# EAGLE board pico (EAGLE 9.4.0)
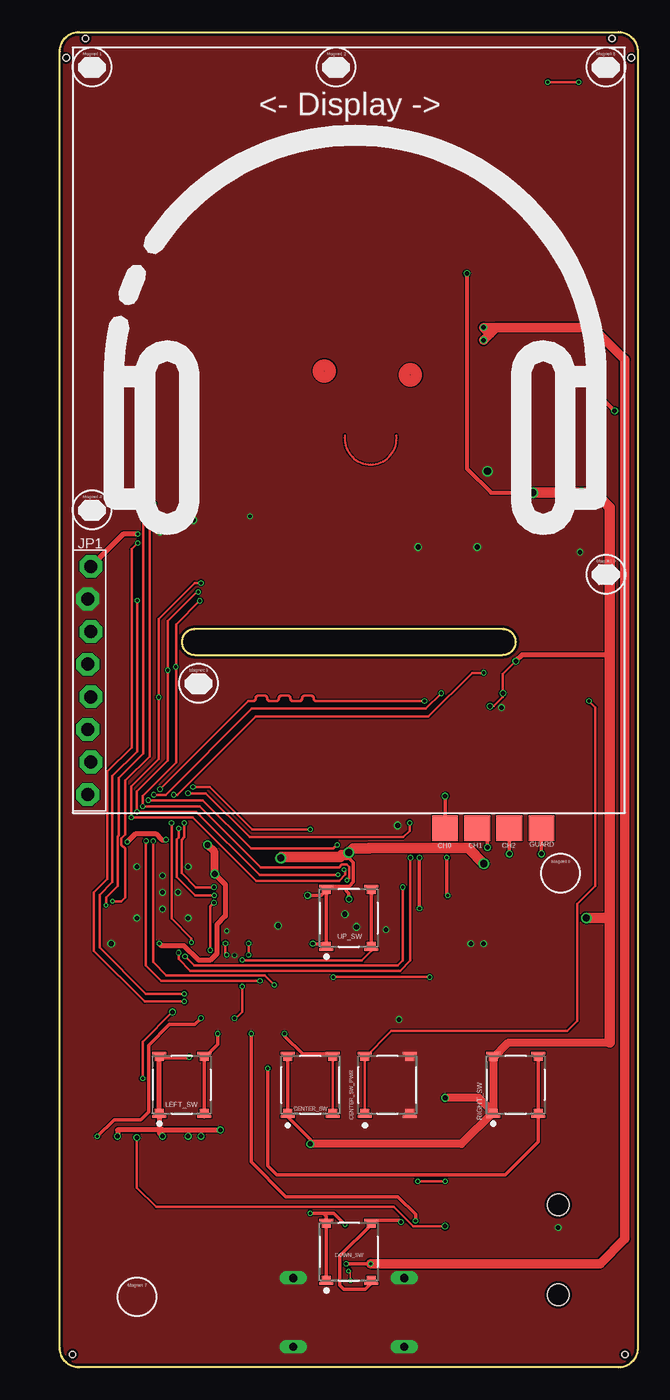
[diagram p10: board, top side]
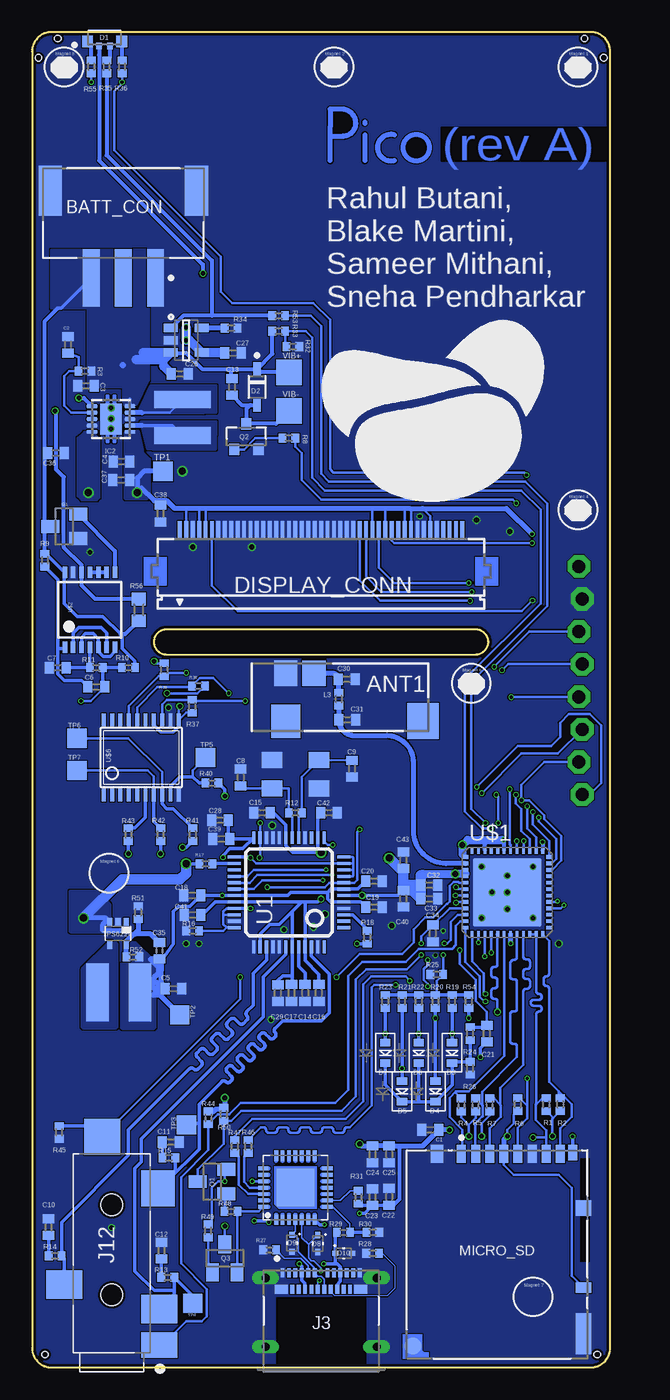
[diagram p11: board, bottom side, seen from below]

Size 45 x 104 mm. Coordinates in mm from the lower left corner, seen from the top.
Outline: 43.5,104 arc-90 45,102.5 45,1.5 arc-90 43.5,0 1.5,0 arc-90 0,1.5 0,102.5 arc-90 1.5,104 43.5,104
Outline: 10.5,55.5 34.5,55.5 arc90 35.5,56.5 arc90 34.5,57.5 10.5,57.5 arc90 9.5,56.5 arc90 10.5,55.5
Copper layers (1*16): Top 0.035mm / dielectric 1.5mm / Bottom 0.035mm
Design rules "jlcpcb": minimum track width 3.5mil, minimum drill 0.2mm, track to track 3.5mil, track to pad 3.5mil, pad to pad 6mil, via to via 6mil, smd to smd 6mil, copper to edge 0.2mm, drill to drill 0.2mm, minimum pad ring 3mil, minimum via ring 3mil, stop-mask expansion 4mil, vias tented up to drill 0mil, thermal gap 10mil
Holes 0.5 mm at 44,1 1,1 0.5,102 44.5,102 2,103.5 43,103.5

## Footprints (pad centres in the part's own frame; a part is rotated, then mirrored left to right if it is on the bottom)
PRO-OB-440_1 = smd 2 x 1.8: 1 1.865,-2.65; 2 1.865,-4.85 | smd 2.6 x 2.25: 3 -1.865,-2.65 | smd 2.8 x 2.45: 4 -1.865,-13.35
JST_S3B-XH-SM4-TB_0 = smd 1.3 x 4.5: 1 -2.5,5.05; 2 0,5.05; 3 2.5,5.05 | smd 1.8 x 3.9: 4 -5.7,-1.75; 5 5.7,-1.75
C0402 = smd 0.7 x 0.9: 1 -0.65,0; 2 0.65,0
E-SWITCH_TL3315NF100Q_0 = smd 0.5 x 0.7: 1 -2.125,1.75; 2 2.125,1.75; 3 -2.125,-1.75; 4 2.125,-1.75 | smd 0.2 x 1.1: 1-2 -2.475,1.75; 2-2 2.475,1.75; 3-2 -2.475,-1.75; 4-2 2.475,-1.75
TP20SQ = smd 2 x 2: TP 0,0
BROADCOM_HSMF-C113_0 = smd 0.85 x 0.9: 1 -1.325,-0.25; 4 1.325,-0.25 | smd 0.45 x 0.5: 2 -0.425,-0.6; 3 0.425,-0.6
ON_SEMI_1N914BWS_0 = smd 1.05 x 0.55: 1 -1.4,0; 2 1.4,0
SOD-523 = smd 0.8 x 0.6: A 0,-0.8; K 0,0.8
ON_SEMICONDUCTOR_ESD5Z5.0T1G_0 = smd 0.48 x 0.4: 1 -0.66,0; 2 0.66,0
FH12-45S-0.5SH = smd 0.3 x 1.3: 1 -13,3.25; 2 -12.5,3.25; 3 -12,3.25; 4 -11.5,3.25; 5 -11,3.25; 6 -10.5,3.25; 7 -10,3.25; 8 -9.5,3.25; 9 -9,3.25; 10 -8.5,3.25; 11 -8,3.25; 12 -7.5,3.25; 13 -7,3.25; 14 -6.5,3.25; 15 -6,3.25; 16 -5.5,3.25; 17 -5,3.25; 18 -4.5,3.25; 19 -4,3.25; 20 -3.5,3.25; 21 -3,3.25; 22 -2.5,3.25; 23 -2,3.25; 24 -1.5,3.25; 25 -1,3.25; 26 -0.5,3.25; 27 0,3.25; 28 0.5,3.25; 29 1,3.25; 30 1.5,3.25; 31 2,3.25; 32 2.5,3.25; 33 3,3.25; 34 3.5,3.25; 35 4,3.25; 36 4.5,3.25; 37 5,3.25; 38 5.5,3.25; 39 6,3.25; 40 6.5,3.25; 41 7,3.25; 42 7.5,3.25; 43 8,3.25; 44 8.5,3.25; 45 9,3.25
E-SWITCH_TL3315NF160Q_0 = smd 0.5 x 0.7: 1 -2.125,1.75; 2 2.125,1.75; 3 -2.125,-1.75; 4 2.125,-1.75 | smd 0.2 x 1.1: 1-2 -2.475,1.75; 2-2 2.475,1.75; 3-2 -2.475,-1.75; 4-2 2.475,-1.75
SOT23 = smd 1 x 1.4: 1 -0.95,-1.1; 2 0.95,-1.1; 3 0,1.1
DRC-S-PVSON-N10 = smd 0.28 x 0.85: 1 -1,-1.475; 2 -0.5,-1.475; 3 0,-1.475; 4 0.5,-1.475; 5 1,-1.475; 6 1,1.475; 7 0.5,1.475; 8 0,1.475; 9 -0.5,1.475; 10 -1,1.475 | smd 2.4 x 1.65: TH 0,0
MOLEX_105450-0101_0 = drill 0.635 pad 1.067 long: 1 -4.32,3.36; 2 4.32,3.36; 3 -4.32,-2; 4 4.32,-2 | smd 0.3 x 0.7: A1 -3,3.77; A2 -2.5,3.77; A3 -2,3.77; A4 -1.5,3.77; A5 -1,3.77; A6 -0.5,3.77; A7 0.5,3.77; A8 1,3.77; A9 1.5,3.77; A10 2,3.77; A11 2.5,3.77; A12 3,3.77; B2 2.25,2.47; B3 1.75,2.47; B4 1.25,2.47; B5 0.75,2.47; B6 0.25,2.47; B7 -0.25,2.47; B8 -0.75,2.47; B9 -1.25,2.47; B10 -1.75,2.47; B11 -2.25,2.47 | smd 1 x 0.7: B1 3.1,2.47; B12 -3.1,2.47
CUI_SJ-43515TS-SMT = smd 2 x 2.8: 1 -7.15,-3.7 | smd 2.8 x 2.6: 2 5.05,-3.6 | smd 2.2 x 2.8: 3 -2.45,3.7; 4 -4.35,-3.7 | smd 2.8 x 2.8: 5 9.05,0.75 | hole 1.7: -3.25,0; 3.75,0
QFN28 = smd 2.9 x 2.9: P$0 0,0 | smd 0.8 x 0.3: P$1 -2.5,1.5; P$2 -2.5,1; P$3 -2.5,0.5; P$4 -2.5,0; P$5 -2.5,-0.5; P$6 -2.5,-1; P$7 -2.5,-1.5; P$15 2.5,-1.5; P$16 2.5,-1; P$17 2.5,-0.5; P$18 2.5,0; P$19 2.5,0.5; P$20 2.5,1; P$21 2.5,1.5 | smd 0.3 x 0.8: P$8 -1.5,-2.5; P$9 -1,-2.5; P$10 -0.5,-2.5; P$11 0,-2.5; P$12 0.5,-2.5; P$13 1,-2.5; P$14 1.5,-2.5; P$22 1.5,2.5; P$23 1,2.5; P$24 0.5,2.5; P$25 0,2.5; P$26 -0.5,2.5; P$27 -1,2.5; P$31 -1.5,2.5
1X08-LOCK = drill 1.016 pad 1.778 octagon: 1 -8.89,0.127; 2 -6.35,-0.127; 3 -3.81,0.127; 4 -1.27,-0.127; 5 1.27,0.127; 6 3.81,-0.127; 7 6.35,0.127; 8 8.89,-0.127
R0402 = smd 0.6 x 0.7: 1 -0.5,0; 2 0.5,0
HIROSE_DM3BT-DSF-PEJS_0 = smd 0.7 x 1.4: 1 -2.775,7.825; 2 -1.675,7.825; 3 -0.575,7.825; 4 0.525,7.825; 5 1.625,7.825; 6 2.725,7.825; 7 3.825,7.825; 8 4.925,7.825 | smd 0.7 x 1.2: 9 5.875,7.925 | smd 1.2 x 0.8: 10 6.725,-2.575 | smd 1 x 1.4: 11 -4.675,7.825 | smd 1.2 x 1.2: 12 6.725,3.625 | smd 1.311 x 1.311: 13 -6.553,-7.116 | smd 1.2 x 3.2: 14 6.725,-6.175
ON_SEMI_MMBT5551LT1G_0 = smd 0.9 x 0.8: 1 -1,0.95; 2 -1,-0.95; 3 1,0
R0603 = smd 1 x 1.1: 1 -0.85,0; 2 0.85,0
TP15SQ = smd 1.5 x 1.5: TP 0,0
TSP62240 = smd 0.4 x 0.7: 1 -0.65,-0.85; 2 0,-0.85; 3 0.65,-0.85; 4 0.65,0.85; 5 -0.65,0.85
LQFP48 = smd 0.25 x 1: 1 -2.75,-4.25; 2 -2.25,-4.25; 3 -1.75,-4.25; 4 -1.25,-4.25; 5 -0.75,-4.25; 6 -0.25,-4.25; 7 0.25,-4.25; 8 0.75,-4.25; 9 1.25,-4.25; 10 1.75,-4.25; 11 2.25,-4.25; 12 2.75,-4.25; 25 2.75,4.25; 26 2.25,4.25; 27 1.75,4.25; 28 1.25,4.25; 29 0.75,4.25; 30 0.25,4.25; 31 -0.25,4.25; 32 -0.75,4.25; 33 -1.25,4.25; 34 -1.75,4.25; 35 -2.25,4.25; 36 -2.75,4.25 | smd 1 x 0.25: 13 4.25,-2.75; 14 4.25,-2.25; 15 4.25,-1.75; 16 4.25,-1.25; 17 4.25,-0.75; 18 4.25,-0.25; 19 4.25,0.25; 20 4.25,0.75; 21 4.25,1.25; 22 4.25,1.75; 23 4.25,2.25; 24 4.25,2.75; 37 -4.25,2.75; 38 -4.25,2.25; 39 -4.25,1.75; 40 -4.25,1.25; 41 -4.25,0.75; 42 -4.25,0.25; 43 -4.25,-0.25; 44 -4.25,-0.75; 45 -4.25,-1.25; 46 -4.25,-1.75; 47 -4.25,-2.25; 48 -4.25,-2.75
MICROCHIP_MCP73831T-2ATI-OT_1 = smd 1.1 x 0.65: 1 -1.2,0.95; 2 -1.2,0; 3 -1.2,-0.95; 4 1.2,-0.95; 5 1.2,0.95
QFN48 = smd 0.55 x 0.3: 1 -3.275,2.75; 2 -3.275,2.25; 3 -3.275,1.75; 4 -3.275,1.25; 5 -3.275,0.75; 6 -3.275,0.25; 7 -3.275,-0.25; 8 -3.275,-0.75; 9 -3.275,-1.25; 10 -3.275,-1.75; 11 -3.275,-2.25; 12 -3.275,-2.75; 25 3.275,-2.75; 26 3.275,-2.25; 27 3.275,-1.75; 28 3.275,-1.25; 29 3.275,-0.75; 30 3.275,-0.25; 31 3.275,0.25; 32 3.275,0.75; 33 3.275,1.25; 34 3.275,1.75; 35 3.275,2.25; 36 3.275,2.75 | smd 0.3 x 0.55: 13 -2.75,-3.275; 14 -2.25,-3.275; 15 -1.75,-3.275; 16 -1.25,-3.275; 17 -0.75,-3.275; 18 -0.25,-3.275; 19 0.25,-3.275; 20 0.75,-3.275; 21 1.25,-3.275; 22 1.75,-3.275; 23 2.25,-3.275; 24 2.75,-3.275; 37 2.75,3.275; 38 2.25,3.275; 39 1.75,3.275; 40 1.25,3.275; 41 0.75,3.275; 42 0.25,3.275; 43 -0.25,3.275; 44 -0.75,3.275; 45 -1.25,3.275; 46 -1.75,3.275; 47 -2.25,3.275; 48 -2.75,3.275 | smd 5.309 x 5.309: EXP 0,0
TSSOP14 = smd 0.35 x 0.9: 1 -1.95,-2.925; 2 -1.3,-2.925; 3 -0.65,-2.925; 4 0,-2.925; 5 0.65,-2.925; 6 1.3,-2.925; 7 1.95,-2.925; 8 1.95,2.925; 9 1.3,2.925; 10 0.65,2.925; 11 0,2.925; 12 -0.65,2.925; 13 -1.3,2.925; 14 -1.95,2.925
INDUCTOR = smd 1.3 x 4.4: P$1 -1.5,0.2; P$2 1.3,0.2
ECSCRYSTAL = smd 1.6 x 1.25: GND -1.83,1.12; GND2 1.84,-1.11; IN/OUT 1.82,1.12; IN/OUT2 -1.83,-1.11
INDUCTOR' = smd 1.75 x 4.5: P$1 -1.4,0.2; P$2 1.9,0.2
TSSOP20 = smd 0.305 x 0.991: 1 -2.925,-2.918; 2 -2.275,-2.918; 3 -1.625,-2.918; 4 -0.975,-2.918; 5 -0.325,-2.918; 6 0.325,-2.918; 7 0.975,-2.918; 8 1.625,-2.918; 9 2.275,-2.918; 10 2.925,-2.918; 11 2.925,2.918; 12 2.275,2.918; 13 1.625,2.918; 14 0.975,2.918; 15 0.325,2.918; 16 -0.325,2.918; 17 -0.975,2.918; 18 -1.625,2.918; 19 -2.275,2.918; 20 -2.925,2.918

## Placement (x,y rotation side)
ANT1  PRO-OB-440  [PRO-OB-440_1]  27.9,52.2 90 bottom
BATT_CON  JST_S3B-XH-SM4-TBJST_S3B-XH-SM4-TB_0_0  [JST_S3B-XH-SM4-TB_0]  37.9,89.9 180 bottom
C1  50μF  [C0402]  14,18.5 180 bottom
C2  0.1μF  [C0402]  42.2,79.65 90 bottom
C3  10μF  [C0402]  40.8,76.44 180 bottom
C4  10μF  [C0402]  38.04,70.55 180 bottom
C5  10μF  [C0402]  34,29.5 0 bottom
C6  1μF  [C0402]  40,53 180 bottom
C7  1μF  [C0402]  43,54.5 0 bottom
C8  33pF  [C0402]  28.76,45.94 270 bottom
C9  33pF  [C0402]  20.09,46.63 90 bottom
C10  10nF  [C0402]  43.73,10.92 90 bottom
C11  10nF  [C0402]  34.21,17.54 0 bottom
C12  47nF  [C0402]  34.93,9.09 90 bottom
C13  0.1μF  [C0402]  29.43,76.36 270 bottom
C14  1μF  [C0402]  23.74,29.17 270 bottom
C15  100nF  [C0402]  27.1,43.2 180 bottom
C16  100nF  [C0402]  22.68,29.17 270 bottom
C17  100nF  [C0402]  24.8,29.17 270 bottom
C18  100nF  [C0402]  32.53,36.76 180 bottom
C19  100nF  [C0402]  18.38,35.85 0 bottom
C20  100nF  [C0402]  18.38,37.87 0 bottom
C21  0.1μF  [C0402]  9.6,26 90 bottom
C22  4.7μF  [C0402]  17.2,13.28 90 bottom
C23  0.1μF  [C0402]  18.5,13.27 90 bottom
C24  4.7μF  [C0402]  18.5,16.6 270 bottom
C25  0.1μF  [C0402]  17.2,16.6 270 bottom
C26  4.7μF  [C0402]  33.5,77.39 0 bottom
C27  4.7μF  [C0402]  29.36,79 0 bottom
C28  10μF  [C0402]  30.36,42.61 180 bottom
C29  10μF  [C0402]  25.87,29.16 270 bottom
C30  2.7pF  [C0402]  20.5,53.6 0 bottom
C31  4.7pF  [C0402]  20.47,50.44 0 bottom
C32  10μF  [C0402]  14.08,37.56 0 bottom
C33  0.1μF  [C0402]  14.08,36.49 0 bottom
C34  0.1μF  [C0402]  13.8,33.8 270 bottom
C35  33pF  [C0402]  35.09,32.45 90 bottom
C36  100nF  [C0402]  43.15,71.21 0 bottom
C37  10μF  [C0402]  38.06,69.11 180 bottom
C38  0.1μF  [C0402]  35,66.5 270 bottom
C39  100nF  [C0402]  30.27,41.16 180 bottom
C40  100nF  [C0402]  16.1,36.5 270 bottom
C41  100nF  [C0402]  32.52,35.24 180 bottom
C42  100nF  [C0402]  21.89,43.2 0 bottom
C43  10μF  [C0402]  16.1,39.5 90 bottom
CENTER_SW  E-SWITCH_TL3315NF100QE-SWITCH_TL3315NF100Q_0_0  [E-SWITCH_TL3315NF100Q_0]  19.5,22 90 top
CENTER_SW_PWR  E-SWITCH_TL3315NF100QE-SWITCH_TL3315NF100Q_0_0  [E-SWITCH_TL3315NF100Q_0]  25.5,22 90 top
CH0  TPSQTP20SQ  [TP20SQ]  30,42 180 top
CH1  TPSQTP20SQ  [TP20SQ]  32.5,42 180 top
CH2  TPSQTP20SQ  [TP20SQ]  35,42 180 top
D1  BROADCOM_HSMF-C113BROADCOM_HSMF-C113_0_0  [BROADCOM_HSMF-C113_0]  39.36,103.51 0 bottom
D2  ON_SEMI_1N914BWSON_SEMI_1N914BWS_0_0  [ON_SEMI_1N914BWS_0]  27.49,76.36 270 bottom
D3  [SOD-523]  12.3,24.5 180 bottom
D4  [SOD-523]  13.6,21.5 180 bottom
D5  [SOD-523]  16.2,21.5 180 bottom
D6  [SOD-523]  14.9,24.5 180 bottom
D7  [SOD-523]  17.5,24.5 180 bottom
D8  ON_SEMICONDUCTOR_ESD5Z5.0T1GON_SEMICONDUCTOR_ESD5Z5.0T1G_0_0  [ON_SEMICONDUCTOR_ESD5Z5.0T1G_0]  22.76,9.65 270 bottom
D9  ON_SEMICONDUCTOR_ESD5Z5.0T1GON_SEMICONDUCTOR_ESD5Z5.0T1G_0_0  [ON_SEMICONDUCTOR_ESD5Z5.0T1G_0]  24.77,9.67 270 bottom
D10  ON_SEMICONDUCTOR_ESD5Z5.0T1GON_SEMICONDUCTOR_ESD5Z5.0T1G_0_0  [ON_SEMICONDUCTOR_ESD5Z5.0T1G_0]  20.74,8.89 0 bottom
DISPLAY_CONN  FH12-45S-0.5SH  [FH12-45S-0.5SH]  20.5,62 0 bottom
DOWN_SW  E-SWITCH_TL3315NF160QE-SWITCH_TL3315NF160Q_0_0  [E-SWITCH_TL3315NF160Q_0]  22.5,9 90 top
G1  APX809S-31SA  [SOT23]  42.5,65.5 90 bottom
GUARD  TPSQTP20SQ  [TP20SQ]  37.5,42 180 top
IC2  TPS6300  [DRC-S-PVSON-N10]  38.86,73.86 90 bottom
J3  MOLEX_105450-0101MOLEX_105450-0101_0_0  [MOLEX_105450-0101_0]  22.5,3.6 0 bottom
J12  3.5mm TRRS Jack  [CUI_SJ-43515TS-SMT]  38.8,8.9 90 bottom
JL  CP2102N-A02-GQFN28  [QFN28]  24.5,14 90 bottom
JP1  [1X08-LOCK]  2.3,53.5 90 top
L3  1.6nH  [R0402]  21.13,52.05 270 bottom
LEFT_SW  E-SWITCH_TL3315NF160QE-SWITCH_TL3315NF160Q_0_0  [E-SWITCH_TL3315NF160Q_0]  9.5,22 90 top
MICRO_SD  HIROSE_DM3BT-DSF-PEJSHIROSE_DM3BT-DSF-PEJS_0_0  [HIROSE_DM3BT-DSF-PEJS_0]  8.8,8.8 0 bottom
Q1  [SOT23]  30.99,14.47 90 bottom
Q2  ON_SEMI_MMBT5551LT1GON_SEMI_MMBT5551LT1G_0_0  [ON_SEMI_MMBT5551LT1G_0]  28.32,72.5 90 bottom
Q3  [SOT23]  30,8.5 0 bottom
R1  10kΩ  [R0402]  4.98,20.47 270 bottom
R2  10kΩ  [R0402]  3.88,20.48 270 bottom
R3  100Ω  [R0402]  40.88,77.6 0 bottom
R4  10kΩ  [R0402]  11.57,20.45 270 bottom
R5  10kΩ  [R0402]  10.47,20.45 270 bottom
R6  10kΩ  [R0402]  7.19,20.48 270 bottom
R7  10kΩ  [R0402]  9.38,20.45 270 bottom
R8  1.5kΩ  [R0402]  25.01,72.38 180 bottom
R9  100kΩ  [R0402]  44,62.87 90 bottom
R10  100kΩ  [R0402]  37.5,54.5 0 bottom
R11  10MΩ  [R0402]  40,54.5 180 bottom
R12  1MΩ  [R0402]  24.5,43.2 0 bottom
R13  10Ω  [R0402]  34.44,7 180 bottom
R14  20Ω  [R0402]  43.21,8.7 180 bottom
R15  20Ω  [R0402]  34.35,16.33 180 bottom
R16  100kΩ  [R0402]  32.5,34 180 bottom
R17  100kΩ  [R0402]  31.47,39.23 180 bottom
R18  100kΩ  [R0402]  18.9,33.5 270 bottom
R19  155kΩ  [R0402]  12.3,28.5 270 bottom
R20  75kΩ  [R0402]  13.6,28.5 270 bottom
R21  35kΩ  [R0402]  16.2,28.5 270 bottom
R22  15kΩ  [R0402]  14.9,28.5 270 bottom
R23  5kΩ  [R0402]  17.5,28.5 270 bottom
R24  50kΩ  [R0402]  10.9,26 90 bottom
R25  5kΩ  [R0402]  13.5,30.6 0 bottom
R26  10kΩ  [R0402]  10.9,23.3 90 bottom
R27  5.1kΩ  [R0402]  26.51,9.14 180 bottom
R28  5.1kΩ  [R0402]  18.49,8.88 180 bottom
R29  22.1kΩ  [R0402]  20.76,10.51 180 bottom
R30  47.5kΩ  [R0402]  18.47,10.53 180 bottom
R31  1kΩ  [R0402]  19.59,13.25 270 bottom
R32  10kΩ  [R0402]  24.7,79.5 180 bottom
R33  5kΩ  [R0402]  25.8,80.7 180 bottom
R34  2kΩ  [R0402]  29.5,80.94 0 bottom
R35  100Ω  [R0402]  39.2,101.3 270 bottom
R36  50Ω  [R0402]  38,101.3 270 bottom
R37  4.7kΩ  [R0402]  32.53,51.49 270 bottom
R38  4.7kΩ  [R0402]  32.05,53.08 0 bottom
R39  4.7kΩ  [R0402]  34.72,54.34 90 bottom
R40  10kΩ  [R0402]  31,45.5 0 bottom
R41  10kΩ  [R0402]  32.5,41.5 270 bottom
R42  10kΩ  [R0402]  35,41.5 270 bottom
R43  10kΩ  [R0402]  37.5,41.5 270 bottom
R44  10kΩ  [R0402]  31.27,19.44 90 bottom
R45  50kΩ  [R0402]  42.9,18.3 270 bottom
R46  1kΩ  [R0402]  28.18,17.21 270 bottom
R47  1kΩ  [R0402]  29.22,17.21 90 bottom
R48  10kΩ  [R0402]  29.51,12.14 180 bottom
R49  10kΩ  [R0402]  31.3,10.64 270 bottom
R50  10kΩ  [R0402]  30.07,19.72 90 bottom
R51  180kΩ  [R0402]  36.73,35.43 270 bottom
R52  360kΩ  [R0402]  37.16,31.96 0 bottom
R53  10kΩ  [R0402]  25.8,81.9 180 bottom
R54  315kΩ  [R0402]  11,28.5 270 bottom
R55  25Ω  [R0402]  40.4,101.3 270 bottom
R56  0Ω  [R0603]  36.7,59 90 bottom
RIGHT_SW  E-SWITCH_TL3315NF160QE-SWITCH_TL3315NF160Q_0_0  [E-SWITCH_TL3315NF160Q_0]  35.5,22 90 top
TP1  TPSQTP15SQ  [TP15SQ]  34.8,69.8 0 bottom
TP2  TPSQTP15SQ  [TP15SQ]  33.5,27.45 270 bottom
TP3  TPSQTP15SQ  [TP15SQ]  32.97,18.9 90 bottom
TP4  TPSQTP15SQ  [TP15SQ]  32.5,5 180 bottom
TP5  TPSQTP15SQ  [TP15SQ]  31.5,47.5 0 bottom
TP6  TPSQTP15SQ  [TP15SQ]  41.5,49 0 bottom
TP7  TPSQTP15SQ  [TP15SQ]  41.5,46.5 0 bottom
TPS6224  TPS62240  [TSP62240]  38.31,33.81 180 bottom
U1  VS1053-L  [LQFP48]  25,37 90 bottom
U2  MICROCHIP_MCP73831T-2ATI-OTMICROCHIP_MCP73831T-2ATI-OT_0_1  [MICROCHIP_MCP73831T-2ATI-OT_1]  33,80 0 bottom
U$1  ESP32-PICO-D4  [QFN48]  8,37 0 bottom
U$2  TOSHIBA-NAND-GATE  [TSSOP14]  40.5,59 0 bottom
U$3  2.2uH  [INDUCTOR]  33.49,73.87 270 bottom
U$4  ECS12P88MHZ  [ECSCRYSTAL]  24.5,46.2 0 bottom
U$5  CR43NP-2R2MC  [INDUCTOR']  38.5,29 0 bottom
U$6  COMMS-AT42QT2120XU  [TSSOP20]  36.5,47.5 0 bottom
UP_SW  E-SWITCH_TL3315NF160QE-SWITCH_TL3315NF160Q_0_0  [E-SWITCH_TL3315NF160Q_0]  22.5,35 90 top
VIB+  TPSQTP20SQ  [TP20SQ]  25,77.5 0 bottom
VIB-  TPSQTP20SQ  [TP20SQ]  25,74.5 0 bottom

## Tracks (layer width: path | path; a pad name or v marks a point on that pad's centre or on a via)
ATQ_CHANGE  (via drill 0.2, 0.25)
  Top 0.2: v10.25,33.1 10.25,33.4 8.7,34.95 v8.7,42.4 | v8.87,44.6 9.16,44.6 15.26,50.7 28.7,50.7 32.1,54.1 v33,54.1
  Bottom 0.2: U$6.17 37.48,51.5 35.14,53.84 R39.1 34.46,54.1 v33,54.1 | U$1.14 v10.25,33.1 | v8.7,42.4 8.7,44.43 v8.87,44.6
BLUE_GREEN_LED_CATH  (via drill 0.2, 0.25)
  Top 0.2: v40.4,100.1 v38,100.1 | v6.5,69.5 6.5,47.8 4.6,45.9 4.6,41.44 4.5,41.34 4.5,37.5 3.6,36.6 v3.6,36
  Bottom 0.2: R36.2 v38,100.1 38,100 38.6,99.4 38.6,94.8 30.3,86.5 30.3,83.8 29.4,82.9 23.1,82.9 21.8,81.6 21.8,69.95 21.55,69.7 6.7,69.7 v6.5,69.5 | v40.4,100.1 R55.2 | U$1.28 3.85,35.75 v3.6,36
BUTTON_ADC  (via drill 0.25)
  Top 0.2: v12.9,33.03 12.9,32.23 v13,32.13
  Bottom 0.2: U$1.10 11.85,35.25 12.4,34.7 12.4,33.3 12.67,33.03 v12.9,33.03 | v13,32.13 R25.2 13.5,30.1 13.5,29
  Bottom 0.254: R54.1 R19.1 13.5,29 R20.1 R22.1 R21.1 R23.1
BUTTON_DIN  (via drill 0.25)
  Top 0.2: v11.7,32.5 11.7,35.9 v12,36.2
  Bottom 0.2: C21.2 9.6,27.7 10.46,28.56 10.46,30.2 11.7,31.44 v11.7,32.5 | U$1.8 11.95,36.25 v12,36.2
  Bottom 0.254: R24.2 9.75,26.5 C21.2
CARD_DETECT  (via drill 0.25)
  Top 0.254: v2.93,18 4.23,19.3 6.3,19.3 6.92,19.92 6.92,25.1 8.52,26.7 10.5,26.7 v11,27.2
  Bottom 0.254: MICRO_SD.9 v2.93,18 | v11,27.2 R54.2
CENTER_SW_PWR_TOP  (via drill 0.25)
  Top 0.2: v41.2,51.9 41.7,51.4 41.7,37.5 40.3,36.1 40.3,27 39.5,26.2 25.82,26.2 CENTER_SW_PWR.2 CENTER_SW_PWR.1
  Bottom 0.2: v41.2,51.9 40.45,51.9 C6.1
  Bottom 0.254: R10.1 R11.1 39.5,53.15 C6.1
CHARGE_DETECT  (via drill 0.25)
  Top 0.2: v12,37.4 10.6,37.4 9.5,38.5 9.5,41.1 9.7,41.3 v9.7,42.4
  Bottom 0.2: R53.1 23.3,81.9 22.5,81.1 22.5,69.6 21.9,69 6.62,69 4.91,67.29 4.91,59.29 10.8,53.4 10.8,43.5 v9.7,42.4 | v12,37.4 11.85,37.25 U$1.6
CP_RSTB
  Bottom 0.127: JL.P$9 21,13 20.25,13.75 R31.1
DISPLAY_CS  (via drill 0.25)
  Top 0.2: v9.7,28.5 6.6,28.5 2.65,32.45 2.65,37 3.7,38.05 3.7,46.4 5.6,48.3 5.6,63.73 v6.07,64.2
  Bottom 0.2: DISPLAY_CONN.34 17,64.4 16.8,64.2 v6.07,64.2 | v9.7,28.5 9.78,28.5 10.15,28.87 10.15,30.45 11.28,31.58 U$1.12
DISPLAY_RST  (via drill 0.25)
  Top 0.2: v9.7,29.1 6.7,29.1 3.1,32.7 3.1,36.8 4.1,37.8 4.1,46.05 6.04,47.99 v6.04,59.73
  Bottom 0.2: DISPLAY_CONN.6 31,60.9 29,58.9 6.87,58.9 v6.04,59.73 | v9.7,29.1 9.83,29.23 9.83,30.69 10.75,31.61 U$1.13
DREQ  (via drill 0.25)
  Top 0.2: v9.75,32 10.45,31.3 26.3,31.3 26.7,31.7 v26.7,37.4 | v10.37,45.21 11.69,45.21 15,41.9 v19.5,41.9
  Bottom 0.2: U$1.15 v9.75,32 | v26.7,37.4 22.21,37.4 21.86,37.75 U1.8 19.9,37.75 19.7,37.95 19.7,41.7 v19.5,41.9 | JP1.1 1.59,44.61 0.7,45.5 0.7,50 1.6,50.9 3.2,50.9 3.9,50.2 3.9,49.1 4.6,48.4 7.18,48.4 v10.37,45.21
DTR
  Bottom 0.2: JL.P$31 27.36,12.14 R48.1 29.01,7.44 Q3.2
EN  (via drill 0.25)
  Top 0.2: v14.7,32.13 v14.7,33.03
  Bottom 0.2: Q1.3 32.09,15.41 30.07,17.43 R50.1 29.5,19.22 28.72,20 20.9,20 19.8,21.1 19.8,30.2 19,31 15.83,31 v14.7,32.13 | v14.7,33.03 14.7,33.55 C34.1 12.5,35.75 U$1.9
GND  (via drill 0.25, 0.3, 0.35, 0.4, 0.55)
  other vias: 38.84,74.72 38.84,73.89 38.85,73.11 40.5,63.5 34.39,51.39 38.8,10.9 25.4,34.1 32,33 33,33 26.4,27.1 33.3,69.8 8,37 6,39 8,38.3 10,39 9.2,37 8,35.7 10,35 6,35 13.6,32.1 13,34 27.9,63.9 32.5,63.9 26.3,42.21 17,34.4 22.2,35.3 23.1,34.3 14.81,66.29 7.8,65.1 10.4,66 4,33
  pour Top (rank 2, no thermals): 1.5,0 arc-90 0,1.5 0,102.5 arc-90 1.5,104 43.5,104 arc-90 45,102.5 45,1.5 arc-90 43.5,0
  cutout Top (no thermals): 10.5,57.5 arc90 9.5,56.5 arc90 10.5,55.5 34.5,55.5 arc90 35.5,56.5 arc90 34.5,57.5
  cutout Bottom (no thermals): 10.5,57.5 arc90 9.5,56.5 arc90 10.5,55.5 34.5,55.5 arc90 35.5,56.5 arc90 34.5,57.5
  pour Bottom (rank 2, no thermals): 1.5,0 arc-90 0,1.5 0,102.5 arc-90 1.5,104 43.5,104 arc-90 45,102.5 45,1.5 arc-90 43.5,0
I2C_SCL  (via drill 0.25)
  Top 0.2: v7.33,44.6 8.26,44.6 14.96,51.3 28.5,51.3 v29.7,52.5
  Bottom 0.2: U$6.16 36.83,51.41 35.24,53 32.63,53 R38.1 31.93,53.7 30.9,53.7 v29.7,52.5 | U$1.39 6.25,41.15 6.9,41.8 6.9,43.5 7.33,43.93 v7.33,44.6
I2C_SDA  (via drill 0.25)
  Top 0.2: v7.8,45.04 14.67,51.9 15.04,51.9 arc90 15.25,52.11 arc-90 15.46,52.32 15.94,52.32 arc-90 16.15,52.11 arc90 16.36,51.9 16.84,51.9 arc90 17.06,52.11 arc-90 17.27,52.32 17.75,52.32 arc-90 17.96,52.11 arc90 18.17,51.9 18.65,51.9 arc90 18.87,52.11 arc-90 19.08,52.32 19.56,52.32 arc-90 19.77,52.11 arc90 19.98,51.9 v28.4,51.9
  Bottom 0.2: U$6.13 34.88,51.62 34.5,52 R37.1 32.44,51.9 v28.4,51.9 | v7.8,45.04 7.8,40.73 7.75,40.67 U$1.42
IO2  (via drill 0.35)
  Top 0.2: v30,11 27.5,11 26,12.5 7.5,12.5 6,14 v6,17.91
  Bottom 0.2: MICRO_SD.7 4.98,18 | 4.98,18 4.98,18.48 5.78,19.28 5.78,20.47 5.75,20.5 | R1.1 5.28,20.97 5.75,20.5 | 5.75,20.5 5.75,27.5 arc90 5.54,27.71 arc-90 5.33,27.92 5.33,27.96 arc-90 5.54,28.17 5.96,28.17 arc90 6.17,28.38 6.17,28.42 arc90 5.96,28.63 5.54,28.63 arc-90 5.33,28.84 5.33,28.88 arc-90 5.54,29.09 arc90 5.75,29.3 U$1.23 U$1.22 | Q3.3 v30,11 | v6,17.91 5.07,17.91 4.98,18
IO4
  Bottom 0.2: MICRO_SD.8 3.88,18.62 3,19.5 3,20.5 3.5,21 | 3.5,21 3.86,21 R2.1 4,21.1 4,21.5 | U$1.24 4.75,33.23 4.75,30.66 arc90 4.96,30.45 arc-90 5.17,30.24 5.17,29.92 arc-90 4.96,29.71 arc90 4.75,29.5 4.75,22.25 4,21.5 | 3.5,21 4,21.5
IO12
  Bottom 0.2: MICRO_SD.1 11.5,16.7 11.5,18.5 12.5,19.5 12.5,21 12,21.5 | U$1.18 8.25,24.27 11.02,21.5 12,21.5 | R4.1 12,21.38 12,21.5
IO13
  Bottom 0.2: MICRO_SD.2 10.5,16.65 10.5,19 10,19.5 9.93,19.57 9.93,20.41 9.94,20.42 | 9.94,20.42 R5.1 | U$1.20 7.25,31.96 arc90 7.46,31.75 arc-90 7.78,31.43 7.78,30.45 arc-90 7.57,30.24 7.46,30.24 arc90 7.25,30.03 7.25,27.94 arc90 7.46,27.72 7.57,27.72 arc-90 7.78,27.51 7.78,25.42 arc-90 7.57,25.21 7.46,25.21 arc90 7.25,25 7.25,24.17 9.94,21.48 9.94,20.42
IO14  (via drill 0.25, 0.35)
  Top 0.2: v8.77,27.68 6.45,25.36 v6.45,22.51
  Bottom 0.2: MICRO_SD.5 7.18,18.66 6.44,19.39 6.44,20.36 | 8.77,33.71 8.77,31.39 arc90 8.98,31.18 9.03,31.18 arc-90 9.24,30.97 9.24,30.57 arc-90 9.03,30.36 8.98,30.36 arc90 8.77,30.15 8.77,29.75 arc90 8.98,29.53 9.03,29.53 arc-90 9.24,29.32 9.24,28.92 arc-90 9.03,28.71 8.98,28.71 arc90 8.77,28.5 v8.77,27.68 | R6.1 7.06,20.98 6.44,20.36 | 6.44,20.36 v6.44,22.5 v6.45,22.51
  Bottom 0.254: 8.77,33.71 U$1.17
IO15
  Bottom 0.2: MICRO_SD.3 9.38,18.62 8.5,19.5 8.5,20.42 8.54,20.46 | R7.1 9.03,20.95 8.54,20.46 | U$1.21 6.75,32 arc-90 6.54,31.79 6.45,31.79 arc90 6.23,31.58 6.23,31.23 arc90 6.45,31.02 6.54,31.02 arc-90 6.75,30.81 6.75,30.47 arc-90 6.54,30.26 6.45,30.26 arc90 6.23,30.05 6.23,29.7 arc90 6.45,29.49 6.54,29.49 arc-90 6.75,29.28 6.75,23.58 8.54,21.79 8.54,20.46
N$1
  Bottom 0.305: C13.2 28.68,74.96 28,74.96 | 28,74.96 D2.2 | 28,74.96 28.32,74.64 Q2.3 26,73.5 VIB-.TP
N$2
  Bottom 0.305: R55.1 40.4,102.97 D1.1
N$3
  Bottom 0.2: C2.1 41.38,78.69 R3.1 42.1,77.6 42.5,77.2 42.5,74.91 41.95,74.36 IC2.7
  Bottom 0.254: IC2.7 IC2.8
N$4
  Bottom 0.2: C8.2 28.56,45.09 U$4.IN/OUT2 25,45.09 R12.1 24.75,42.95 U1.18
N$5
  Bottom 0.254: R9.1 43,61.37 43,56 | C6.2 41.15,53.5 42.5,53.5 43,54 43,56 | U$2.1 42.52,56 43,56
N$6
  Bottom 0.254: U$3.P$2 34.08,73.36 36.45,73.36
  Bottom 0.406: 36.45,73.36 IC2.2
  pour Bottom (no thermals): 36.51,73.61 36.5,73.62 30.72,73.66 30.73,71.54 35.58,71.52 36,71.55
N$7
  Top 0.16: 22.2,72.6 arc195 26.2,72.6
N$8
  Bottom 0.2: U$3.P$1 34.3,74.36 36.45,74.36
  Bottom 0.406: 36.45,74.36 IC2.4
  pour Bottom (no thermals): 30.71,74.41 30.7,76.45 35.42,76.42 35.75,76.44 36.58,74.65 36.59,74.38 31.63,74.38
N$10
  pour Bottom (no thermals): 38.5,33 38.5,26.5 41,26.5 41,31 39,33
N$11
  Bottom 0.2: 32.5,46 32.5,46.5 TP5.TP
  Bottom 0.254: R40.1 32,45.5 32.5,46 33.5,46 34.23,45.27 U$6.9
N$12
  Bottom 0.254: U$2.7 38.55,55.76 38.92,55.38 39.48,55.38 39.85,55.76 U$2.5 | U$2.3 41.15,56.86 40.87,57.14 40.23,57.14 39.84,56.75 39.84,56.74 39.84,56.09
  Bottom 0.305: 39.84,56.09 U$2.5
N$13
  Bottom 0.406: 21.8,94 21.8,95.9 | 21.8,95.9 21.8,96.6 21.8,98 20.9,98 arc90 19.8,96.9 arc90 20.8,95.9 21.8,95.9
N$14
  Bottom 0.254: U$2.4 R11.2 C7.2
N$15
  Bottom 0.406: 19.1,96 19.1,94
N$16  (via drill 0.25)
  Top 0.2: UP_SW.3-2 24.25,32.45 23.5,31.7 14.23,31.7 v14.2,31.73 | v14.2,29.68 14.2,27.7 13.7,27.2 v13.6,27.2
  Top 0.254: UP_SW.3 UP_SW.4
  Bottom 0.2: v14.2,31.73 14.2,31.32 14.49,31.03 14.49,30.17 14.2,29.88 v14.2,29.68
  Bottom 0.254: R20.2 v13.6,27.2 D4.A
N$18  (via drill 0.35)
  Top 0.254: CH1.TP 33.3,41.2 v33.3,40.5
  Bottom 0.254: v33.3,40.5 33,40.5 R41.2
N$19
  Bottom 0.254: U$2.6 39.2,57.2 39.62,57.62 41.36,57.62 41.8,57.18 U$2.2
N$20  (via drill 0.35)
  Top 0.254: CH2.TP v35,40
  Bottom 0.254: v35,40 R42.2
N$21
  Bottom 0.2: C9.2 22.65,47.29 U$4.IN/OUT 24,46 R12.2 24.25,42.95 U1.17
N$22
  Bottom 0.2: R8.2 27.61,72.39 28.5,71.5 Q2.1
N$23
  Bottom 0.2: U$6.8 34.88,46.38 37.5,49 TP6.TP
  Bottom 0.254: R41.1 34,43.5 34.5,43.5 34.88,43.88 U$6.8
N$24  (via drill 0.25)
  Top 0.254: RIGHT_SW.4 RIGHT_SW.3 37.25,17.58 34.67,15 16.9,15 16.2,15.7 v16.2,23.3
  Bottom 0.254: R21.2 v16.2,23.3 D5.A
N$25
  Bottom 0.2: U$6.7 35.52,46.02 36,46.5 TP7.TP
  Bottom 0.254: R42.1 35.52,42.52 U$6.7
N$26
  Bottom 0.254: R43.1 37,42 36.17,42.83 U$6.6
N$27
  Bottom 0.254: U1.26 30.95,39.25 R17.1
N$28  (via drill 0.25)
  Top 0.254: DOWN_SW.4 21.8,8.67 21.8,6.4 22.1,6.1 23.8,6.1 24.25,6.55 DOWN_SW.3 | DOWN_SW.4-2 26.41,11.48 v26.57,11.32 | v27.7,11.43 27.7,11.93 26.33,13.3 17.6,13.3 14.9,16 v14.9,26
  Bottom 0.254: v26.57,11.32 26.68,11.43 v27.7,11.43 | R22.2 v14.9,26 D6.A
N$29  (via drill 0.25)
  Top 0.2: CENTER_SW.4 CENTER_SW.3
  Top 0.254: CENTER_SW.4 20.98,24.4 18.9,24.4 17.5,25.8 v17.5,26
  Bottom 0.254: R23.2 v17.5,26 D7.A
N$30
  Bottom 0.406: ANT1.2 21.61,54.06 arc90 C30.1 21.15,52.57 arc-90 L3.1
N$31
  Bottom 0.406: L3.2 C31.1 arc-90 19.88,49.2 17.4,49.2 arc90 15.3,47.1 15.3,41.79 arc-90 12.76,39.25 U$1.2
N$32
  Bottom 0.254: R24.1 R26.2 12.2,23.8 D3.K 12.3,22 D4.K 14.9,20.7 | 14.9,20.7 D5.K 17.5,22 D7.K | D6.K 14.9,20.7
N$33
  Bottom 0.305: U$2.9 U$2.10 U$2.11
N$34
  Bottom 0.254: R13.2 C12.1
N$35
  Bottom 0.254: R14.2 43.71,10.25 C10.1
N$36
  Bottom 0.254: C11.1 R15.2
N$37  (via drill 0.35)
  Top 0.254: CH0.TP v30,44.5
  Bottom 0.254: v30,44.5 30,45 R40.2
N$39
  Bottom 0.254: C14.1 23.74,30.74 24.25,31.25 U1.44
N$40  (via drill 0.35)
  Top 0.254: GUARD.TP v37.5,40
  Bottom 0.254: v37.5,40 R43.2
N$41
  Bottom 0.254: U1.3 20.05,35.25 18.9,34.1 R18.1
N$42
  Bottom 0.406: R52.1 TPS6224.5 37.66,33.17 37.07,33.76 37,33.76 | C35.2 35.75,33.76 37,33.76 | R51.2 36.73,34.03 37,33.76
N$43
  Bottom 0.305: G1.2 38.55,63.6 U$2.8
N$44
  Bottom 0.406: 19.1,97 19.1,96.9
N$45  (via drill 0.25)
  Top 0.254: v28,35.75 v28,39.7
  Bottom 0.2: 29.85,34.25 30.1,34.5 30.1,35.2 | U1.33 29.85,35.75 30.1,35.5 30.1,35.2 | U1.36 29.85,34.25 | U1.34 30.05,35.25 30.1,35.2 | 19.99,39.25 19.99,39.69 20.05,39.75 U1.12 | 19.99,39.25 19.99,38.75 | 19.99,38.75 19.99,38.31 20.05,38.25 U1.9 | 19.99,39.25 U1.11 27.54,39.24 v28,39.7 | 19.99,38.75 U1.10 | 29.85,34.25 30.1,34 R16.1
  Bottom 0.254: U1.33 v28,35.75 | v28,39.7 28.05,39.75 U1.25
N$46  (via drill 0.25)
  Top 0.254: LEFT_SW.3-2 LEFT_SW.4 12.3,25.17 v12.3,26
  Bottom 0.254: R19.2 v12.3,26 D3.A
N$47
  Bottom 0.406: 16.8,96 arc-210 16.8,94
N$48
  Bottom 0.254: J12.4 33.94,5.71 33.94,6 | 33.94,6 R13.1 32.5,5.56 TP4.TP | 33.94,6 35.5,6 37,7.5 37,15.5 36.5,16 36.5,17.79 27,27.29 27,30.4 25.25,32.15 U1.42
N$49
  Bottom 0.254: J12.3 42.5,8.49 R14.1 42.71,11.29 37.5,16.5 37.5,18.5 32.75,23.25 arc90 32.41,23.25 arc-90 32.08,23.25 31.82,23.5 arc-90 31.82,23.84 32.16,24.18 arc90 32.16,24.51 31.91,24.77 arc90 31.57,24.77 31.23,24.43 arc-90 30.89,24.43 30.64,24.69 arc-90 30.64,25.02 30.98,25.36 arc90 30.98,25.7 30.72,25.95 arc90 30.39,25.95 30.05,25.61 arc-90 29.71,25.61 29.46,25.87 arc-90 29.46,26.2 29.8,26.54 arc90 29.8,26.88 29.54,27.13 arc90 29.21,27.13 28.87,26.79 arc-90 28.53,26.79 28.28,27.05 arc-90 28.28,27.38 arc90 28.28,27.72 27.8,28.2 27.8,30.7 26.75,31.75 U1.39
N$50
  Bottom 0.102: J3.A5 23.5,7.9 24.08,8.48 25.35,8.48 R27.1
N$51
  Bottom 0.09: R28.1 17.72,8.88 16.77,7.93 16.77,6.17 17.35,5.59 21.45,5.59 21.75,5.88 J3.B5
N$52
  Bottom 0.127: R29.1 20.26,11.17 21.55,12.45 21.59,12.5 JL.P$8
  Bottom 0.254: R29.1 18.99,10.51 R30.2
N$54
  Bottom 0.406: R34.1 U2.5
N$55
  Bottom 0.305: R35.1 38.94,102.06 D1.3
N$56
  Bottom 0.305: R36.1 38,103.22 D1.4
N$57
  Bottom 0.254: R15.1 33.85,15.3 34.58,14.58 | J12.2 34.58,14.58 | U1.46 23.25,32.03 21.87,30.65 21.87,27.63 22.5,27 25.5,27 26.09,26.41 arc-90 26.09,26.08 arc90 26.09,25.74 26.17,25.65 arc90 26.51,25.65 26.85,25.99 arc-90 27.18,25.99 27.27,25.9 arc-90 27.27,25.56 26.93,25.23 arc90 26.93,24.89 27.02,24.8 arc90 27.36,24.8 27.7,25.14 arc-90 28.03,25.14 28.12,25.05 arc-90 28.12,24.71 27.79,24.38 arc90 27.79,24.04 27.88,23.95 arc90 28.21,23.95 28.55,24.29 arc-90 28.88,24.29 28.97,24.2 arc-90 28.97,23.86 28.64,23.53 arc90 28.64,23.19 28.73,23.1 arc90 29.06,23.1 29.4,23.44 arc-90 29.74,23.44 29.82,23.35 arc-90 29.82,23.01 29.49,22.67 arc90 29.49,22.34 29.58,22.25 arc90 29.91,22.25 arc-90 30.25,22.25 32,20.5 32,19 | 32,19 32,17 34.42,14.58 34.58,14.58 | 32,19 32.87,19 TP3.TP
N$58
  Bottom 0.2: Q1.1 30.01,13.4 R48.2
N$59
  Bottom 0.2: Q3.1 31.3,7.75 R49.2
RED_LED_CATH
  Bottom 0.305: U2.1 33.25,81.9 31,81.9 | R53.2 31,81.9 | R35.2 39.2,94.4 31,86.2 31,81.9
RTS  (via drill 0.25)
  Top 0.2: v27.86,14.5 v30,14.5
  Bottom 0.2: Q1.2 30,15.31 v30,14.5 30.5,14.5 31,14 31,11.44 R49.1 | JL.P$24 v27.86,14.5
RXD
  Bottom 0.2: R46.2 28.5,16.39 28.5,14.45 28.05,14 JL.P$25
RXD0  (via drill 0.25)
  Top 0.2: v15.59,30.11 7.89,30.11 6.7,31.3 6.7,40.98 v6.72,41
  Bottom 0.2: R47.2 29.22,18 27.88,19.34 20.6,19.34 19.2,20.74 19.2,29.83 18.59,30.44 15.92,30.44 v15.59,30.11 | U$1.40 6.72,40.3 v6.72,41
SPI_CLK  (via drill 0.2, 0.25)
  Top 0.2: v22.12,38.75 22.24,38.63 22.24,38.4 21.74,37.9 15.3,37.9 10.37,42.83 v5.56,42.83 5.56,45.26 7.7,47.4 v7.7,52.2 7.7,58.3 10.5,61.1 v11,61.1
  Bottom 0.2: DISPLAY_CONN.32 18,62.3 16.8,61.1 v11,61.1 | v22.12,38.75 27.75,38.75 28.25,38.25 U1.28 | v5.56,42.83 5.56,42.53 4.2,41.17 4.2,39.6 4.55,39.25 U$1.35 | v7.7,52.2 7.67,52.23 JP1.4
SPI_MISO  (via drill 0.2, 0.25)
  Top 0.2: v22.37,37.93 22.53,38.09 22.53,38.97 22.33,39.17 21.96,39.17 21.75,38.96 15.64,38.96 10.9,43.7 v6.45,43.7 6.45,44.5 9.05,47.1 9.05,54.54 | v10.9,59.71 9.05,57.86 9.05,54.54 | v9.02,54.57 9.05,54.54
  Bottom 0.2: DISPLAY_CONN.29 19.5,61.3 17.91,59.71 v10.9,59.71 | U1.30 27.75,37.25 27.08,37.92 v22.38,37.92 v22.37,37.93 | v6.45,43.7 6.45,41.98 5.75,41.27 U$1.38 | v9.02,54.57 6.28,57.31 JP1.6
SPI_MOSI  (via drill 0.2, 0.25)
  Top 0.2: v21.65,38.39 21.61,38.35 15.55,38.35 10.64,43.26 v6.01,43.26 6.01,44.86 8.41,47.26 v8.41,54.3 8.41,58.14 10.67,60.4 v10.77,60.4
  Bottom 0.2: DISPLAY_CONN.30 19,61.6 17.8,60.4 v10.77,60.4 | v21.65,38.39 21.69,38.39 21.74,38.34 27.46,38.34 28.05,37.75 U1.29 | U$1.36 4.73,41 6.01,42.28 v6.01,43.26 | v8.41,54.3 7.94,54.77 JP1.5
SYS_ENABLE  (via drill 0.35)
  Top 0.305: v43.2,74.5 42.2,75.5 v41.36,75.5
  Bottom 0.305: v41.36,75.5 40.98,75.5 IC2.6 | v43.2,74.5 43.14,74.44 43.14,69.98 42.52,69.36 42.52,63.87 41.15,62.5 U$2.12 41.15,60.9 40.1,59.85 R56.2
TRRS_INLINE_CTRL
  Bottom 0.2: J12.1 34.85,1.75 33,3.6 31.8,3.6 31.4,4 31.4,6.1 33.4,8.1 33.4,14.8 31.27,16.93 R44.1 31.27,18.98 30.53,19.72 29.65,19.72 28.77,20.6 21.4,20.6 20.4,21.6 20.4,30.5 19.3,31.6 15.9,31.6 14.9,32.6 12.3,32.6 12,32.9 12,34.4 11.65,34.75 U$1.11
TRRS_TIP_SW  (via drill 0.25)
  Top 0.2: v28.8,30.4 v21.3,30.4
  Bottom 0.2: J12.5 28.8,28.7 v28.8,30.4 | v21.3,30.4 19.5,32.2 16.2,32.2 15.3,33.1 15.3,34.11 14.38,35.03 13.77,35.03 12.7,36.1 12.69,36.1 12.49,36.3 12.49,37.52 12.18,37.83 11.82,37.83 11.74,37.75 U$1.5
  Bottom 0.254: J12.5 40.4,18.8 R45.1
TXD
  Bottom 0.2: JL.P$26 28.18,13.5 28.91,14.23 28.91,16.4 R47.1
TXD0  (via drill 0.25)
  Top 0.2: v16.7,29.8 15.96,30.54 8.3,30.54 7.28,31.56 v7.28,40.99
  Bottom 0.2: v16.7,29.8 18.36,29.8 18.56,29.6 18.56,20.41 20.27,18.7 20.47,18.7 arc-90 20.68,18.49 arc90 20.89,18.28 21.34,18.28 arc90 21.55,18.49 arc-90 21.76,18.7 22.21,18.7 arc-90 22.43,18.49 arc90 22.64,18.28 23.09,18.28 arc90 23.3,18.49 arc-90 23.51,18.7 23.96,18.7 arc-90 24.17,18.49 arc90 24.38,18.28 24.83,18.28 arc90 25.04,18.49 arc-90 25.25,18.7 25.7,18.7 arc-90 25.92,18.49 arc90 26.13,18.28 26.58,18.28 arc90 26.79,18.49 arc-90 27,18.7 27.19,18.7 R46.1 | v7.28,40.99 7.28,40.3 U$1.41
USB_D+
  Bottom 0.102: J3.B6 22.25,6.88 22.48,7.11 22.74,7.11 J3.A6 23.02,7.39 23.02,7.76 24.28,9.02 24.28,10.03 24.58,10.33 D9.1 24.5,10.6 JL.P$4
USB_D-  (via drill 0.2)
  Top 0.102: v22.49,7.52 22.63,7.38 v22.63,6.76
  Bottom 0.102: J3.A7 22.15,7.52 v22.49,7.52 22.49,7.73 23.08,8.31 23.26,8.31 23.48,8.53 23.48,9.59 | v22.63,6.76 22.75,6.64 J3.B7 | 23.48,9.59 D8.1 | 23.48,9.59 24,10.11 JL.P$5
V1P8  (via drill 0.25)
  Top 0.254: v30.13,39.71 30.13,36.82 v30.2,36.75
  Bottom 0.254: C18.1 v30.2,36.75 U1.31 25.1,36.75 24.85,37 22,37 | C18.1 | C19.1 19.43,36.25 U1.5 21.75,36.25 22,36.5 22,37 | C20.1 19.65,37.25 U1.7 21.75,37.25 22,37 | C28.1 29.71,41.25 C39.1 27.84,41.16 U1.24 28.6,40.4 29.6,40.4 30.13,39.87 v30.13,39.71 | C18.1 32.71,35.91 33.61,35.91 33.74,35.78 33.74,35.76 34,35.5 34,33 34.94,31.65
  Bottom 0.406: 34.94,30.94 34.94,31.65 C35.1 35.8,31.8 35.2,31.2 35.2,30.7 35.52,30.37 35.52,30.35 35.5,30.37 | 34.94,30.94 35.19,30.69 | 35.19,30.69 35.5,30.37 | 34.94,30 34.94,29.78 34.83,29.67 | 34.94,30 34.94,30.94 | C5.1 34.83,29.67 | C5.1 35,29.5 | 35,29.5 35.22,29.5 | 35.22,29.5 35.5,29.5 36,30 35.5,30 | 35.19,30.69 35,30.5 35,30 | 35,30 35,29.5 | 35.5,30 35.33,30 | 35.33,30 35,30 | 35.5,30 35.5,30.37 | 34.94,30 35,30 | 34.83,29.67 35.01,29.67 35.33,30 | C5.1 35.16,28.99 35.6,28.99 35.22,29.37 35.22,29.5 | TP2.TP 35,28.95 35,29.5
  pour Bottom (no thermals): 37,33 38,33 38,26.5 35.5,26.5 35.5,31.5
V3P3  (via drill 0.2, 0.25, 0.3, 0.35, 0.4, 0.45, 0.55)
  Top 0.2: v35.5,55 34.5,54 v34.5,52.5 34.5,52.2 33.8,51.5 v33.5,51.5 | 10,18.5 v10,18 | 11,18.5 v11,18
  Top 0.254: v22.22,11.11 21.33,12 20.5,12 | 20.5,12 v19.5,12 | 20.5,12 20.75,11.75 DOWN_SW.2 DOWN_SW.1 | 21.98,37.48 UP_SW.2-2 UP_SW.2 | 21.98,37.48 22.52,36.93 v22.52,36.48 | UP_SW.2 20.38,36.75 19.32,36.75 v19.3,36.77 | 24.1,40.43 24.1,40.45 | UP_SW.2 UP_SW.1 20.62,33 v19.7,33 | v10.09,24.16 10.05,24.12 LEFT_SW.2 | CENTER_SW.2 CENTER_SW.1 | CENTER_SW.1-2 19.5,17.77 v19.5,17.4 | 22.3,39.9 22.85,39.34 22.85,37.8 22.52,37.48 21.98,37.48
  Top 0.305: v31.7,85.2 31.7,70 33.58,68.12 37.9,68.12
  Top 0.406: LEFT_SW.2 LEFT_SW.1 7.75,18.75 | v35.5,55 36,55.5 42.82,55.5 | 7.75,18.75 8,18.5 | 8,18.5 10,18.5 11,18.5 v12.5,18.5 | 8,18.5 4.5,18.5 4.5,18.01 v4.48,18 | 7.75,18.75 7.75,18.25 v8,18 | v8.27,41.1 7.94,41.1 7.46,41.58 5.92,41.58 v5.26,40.92 | v12.06,38.43 12.89,37.6 12.9,37.6 12.9,35.15 12.25,34.5 12.25,32.24 11.75,31.74 10.76,31.74 9.67,32.83 7.93,32.83 v7.74,33.02 | v6.07,64.9 4.94,64.9 JP1.8
  Top 0.61: RIGHT_SW.1 RIGHT_SW.2 34.92,25.3 42.82,25.3 | RIGHT_SW.1 31.27,17.4 v19.5,17.4 | RIGHT_SW.1 32.62,21 v30,21 | v11.5,40.7 12.06,40.14 v12.06,38.43
  Top 0.813: v36.83,68.12 37.9,68.12 v40.62,68.12 41.67,68.12 42.82,66.97 42.82,55.5 42.82,35 | 42.82,35 42.82,25.3 | v33.01,39.23 31.79,40.45 24.1,40.45 | v41,35 42.82,35 | 24.1,40.43 22.83,40.43 v22.5,40.1 22.3,39.9 21.95,39.9 21.83,39.77 17.3,39.77 v17.2,39.67
  Bottom 0.2: R38.2 32.13,52.5 v34.5,52.5 | R39.2 35.34,54.84 v35.5,55 | v33.5,51.5 33.58,51.42 U$6.11 33,50.99 R37.2 | v4.48,18 4.48,19.37 4.43,19.43 | 4.43,19.43 R2.2 | 4.43,19.43 4.44,19.43 R1.2 | v8,18 8,18.5 7.5,19 7.5,19.67 R6.2 | v10,18 10,19 9.38,19.62 R7.2 | 11,18.91 11,18.5 v11,18 | R5.2 10.47,19.44 11,18.91 | 11,18.91 11.57,19.48 R4.2 | MICRO_SD.4 8.28,15.77 7.5,15 4,15 3,14 3,7.15 MICRO_SD.10 | 14.6,66.9 14,66.3 DISPLAY_CONN.40 | DISPLAY_CONN.37 15.5,66.8 15.6,66.9 | DISPLAY_CONN.36 16,66.8 16.1,66.9 | DISPLAY_CONN.33 17.5,66.8 17.6,66.9 | DISPLAY_CONN.2 33,66.7 33.2,66.9 | DISPLAY_CONN.4 32,66.8 32.1,66.9 | DISPLAY_CONN.5 31.5,66.8 31.6,66.9 | DISPLAY_CONN.31 18.5,66.8 18.6,66.9 | U$1.3 11.28,38.45 | 11.28,38.45 11.27,38.44 | U$1.4 11.28,38.45 | U$1.1 11.37,39.85
  Bottom 0.254: JL.P$6 JL.P$7 22.61,11.11 v22.22,11.11 | C22.1 C23.1 | C23.1 19.12,12 v19.5,12 | C40.1 16.5,36.75 19.29,36.75 v19.3,36.77 19.32,36.75 U1.6 | v22.52,36.48 22.75,36.25 23.75,36.25 | 24,36.25 U1.32 30.75,36.25 31.76,35.24 C41.1 | 24,36.25 24.75,35.5 | 24.75,35.5 U1.43 24.75,30.5 | 24,36.25 23.75,36.25 | 23.75,36.25 U1.45 23.75,31.68 22.68,30.61 C16.1 | 24.75,35.5 25.75,34.5 26.5,34.5 27.25,33.75 U1.38 | 24.75,30.5 24.75,29.87 C17.1 | C15.1 26.2,43.2 25.25,42.25 U1.19 25.25,40.65 24.7,40.1 v22.5,40.1 22.75,40.35 U1.14 22.75,42.99 C42.1 | 24.75,30.5 25.5,30.5 25.87,30.13 C29.1 | R17.2 v33.01,39.23 | U$6.11 33.58,49.92 34,49.5 35,49.5 35.52,50.02 U$6.14 | C23.1 19.46,12.62 R31.2 | R18.2 v19.7,33 | C21.1 10.09,24.86 v10.09,24.16
  Bottom 0.305: D1.2 39.78,102.21 39.79,102.2 39.79,93.99 31.7,85.9 v31.7,85.2 | v5.26,40.92 5.26,40.28 U$1.37 | 16.4,17.25 16.4,13.1 16.88,12.62 C22.1 | 10.1,41.1 9.75,40.75 U$1.46 | U$1.43 8.25,40.95 8.3,41 | 8.4,41.1 8.3,41 | v8.27,41.1 8.3,41.07 8.3,41
  Bottom 0.406: C38.1 35,67.5 | 35,67.5 34.5,67.5 33.9,66.9 33.2,66.9 32.1,66.9 31.6,66.9 18.6,66.9 17.6,66.9 16.1,66.9 15.6,66.9 14.6,66.9 8.07,66.9 v6.07,64.9 | 35,67.5 35.5,67.5 36.5,68.5 36.83,68.17 | 36.83,68.17 v36.83,68.12 | TPS6224.3 39.15,34.85 | 39.15,34.85 39.3,35 v41,35 | TPS6224.1 37.66,34.34 38,34 39.5,34 39.5,34.5 39.15,34.85 | v8,18 8.28,17.73 MICRO_SD.4 | v12.5,18.5 C1.1 14.6,17.25 16.4,17.25 C25.1 C24.1 19.34,17.24 v19.5,17.4 | TP1.TP 36.3,69.8 36.83,69.27 36.83,68.17 | v30,21 30,20.29 R50.2 30.18,20.11 30.69,20.11 30.87,19.94 R44.2 | 11.5,39.98 11.37,39.85 | v7.74,33.02 7.74,33.72 U$1.19
  Bottom 0.61: 14.73,38.3 14.59,38.44 12,38.44 | 11.27,38.44 12,38.44 | v12.06,38.43 12.01,38.43 12,38.44 | 11.5,39.98 v11.5,40.7 11.1,41.1 10.1,41.1 8.4,41.1
  Bottom 0.813: v33.01,39.23 33.01,38.49 33.5,38 38,38 v41,35 | v17.2,39.67 16.38,38.85 C43.1 16.1,37.56 C32.1 | C32.1 C33.1 15.39,37.15 C40.1 | C32.1 14.73,38.3
  pour Bottom (no thermals): 36.7,72.89 36.38,71.49 36.38,71.29 35.84,70.75 35.84,67.89 36.09,67.64 37.7,67.64 37.78,67.72 37.78,72.81 37.67,72.92 36.72,72.92 36.95,72.86
  pour Bottom (no thermals): 40.95,72.86 41.45,72.36 41.45,67.86 41.14,67.55 39.96,67.55 39.76,67.75 39.76,72.33 40.29,72.86
  pour Bottom (no thermals): 39,35 39,36 40,37 41,37 42,37 42,34.5 42,34 39,34
VBAT
  Bottom 0.2: C36.1 44,71.2
  Bottom 0.254: R10.2 37,55 38,56 38,57 38.1,57.1 39.5,58.5 41.5,58.5 42.5,59.5 42.5,61.88 U$2.14 44,63.48 R9.2 | 36.35,79.05 36.9,78.5 | 34.75,78.5 34.76,78.49 34.76,78 | BATT_CON.3 42.75,82.5 43,82.5 | IC2.5 37.38,75.4 IC2.5
  Bottom 0.305: U2.3 34.15,79 33,79 31.76,77.76 29.5,77.76 | 29.5,77.76 D2.1 | C13.1 29.5,77.08 29.5,77.76 | VIB+.TP 27.23,77.5 D2.1 | 43,82.5 44,81.5 44,71.2 44,65.5 44,63.48 | R56.1 37.75,57.1 38.1,57.1 | D2.1 26.3,78.95 R33.2
  Bottom 0.406: G1.3 44,65.5
  Bottom 0.508: 37.94,78.05 37.93,78.05
  Bottom 0.75: 36.9,78.5 34.75,78.5 U2.3 36.35,79.05 | 34.76,78 C26.1
  pour Bottom (no thermals): 35.95,87 35.95,76.89 36,76.89 36.88,75.01 37.85,75.01 37.85,87
  pour Bottom (no thermals): 37.95,76.36 40.65,76.36 40.65,82.5 43.5,82.5 43.5,87 36.45,87 36.45,76.86
VBAT_ADC_IN  (via drill 0.25)
  Top 0.2: v12.04,36.76 10.54,36.76 9.1,38.2 9.1,41.11 9.26,41.27 v9.26,41.97
  Bottom 0.2: R32.2 25.3,79.6 R33.1 23.7,80.7 23.2,80.2 23.2,69.3 22.2,68.3 6.91,68.3 5.41,66.8 5.41,59.49 11.3,53.6 11.3,43.3 9.97,41.97 v9.26,41.97 | v12.04,36.76 U$1.7
VBUS  (via drill 0.25, 0.35)
  Top 0.2: 24.2,8.06 v24.21,8.07
  Top 0.254: v22.29,8.06 24.2,8.06
  Top 0.75: v24.21,8.07 42.07,8.07 44,10 44,78.5 41.5,81 34,81 | 34,81 33.5,80.5 | 33.5,80.5 v33,80 | 33.5,80.5 v33,81 34,81
  Bottom 0.2: J3.B9 | 21.5,8.06 21.4,8.16
  Bottom 0.254: J3.B4 21.25,6.45 21,6.7 J3.A9 21,7.83 21.23,8.06 21.5,8.06 v22.29,8.06 | J3.B9 23.76,6.56 24,6.8 J3.A4 24,7.86 v24.21,8.07 | 21.4,8.16 D10.1 21.4,10.37 R29.2
  Bottom 0.305: C27.1 30.23,79.05
  Bottom 0.75: v33,81 v33,80 32.75,80 U2.4 30.23,79.05
VIB_MOTOR  (via drill 0.2, 0.25)
  Top 0.2: v7.3,67.3 7,67 7,47.6 5.1,45.7 5.1,41.5 4.8,41.2 4.8,40.7 5.1,40.4 5.1,36.6 4.8,36.3 v4.1,36.3
  Bottom 0.2: R8.1 24.51,71.71 24,71.2 24,69.1 22.5,67.6 7.6,67.6 v7.3,67.3 | U$1.29 4.15,36.25 v4.1,36.3
VS_CMD_CS  (via drill 0.25)
  Top 0.2: v9.25,32.3 9.25,31.8 10.15,30.9 26.5,30.9 27.3,31.7 v27.3,39.7 | v9.98,44.72 11.38,44.72 14.8,41.3 26.74,41.3 27.24,41.8 v27.24,42.41
  Bottom 0.2: U$1.16 v9.25,32.3 | v27.3,39.7 27.25,39.75 U1.23 v27.24,42.41 | JP1.3 4.06,47.8 6.9,47.8 v9.98,44.72
VS_DATA_CS  (via drill 0.25)
  Top 0.2: v6.9,44.17 11.13,44.17 14.9,40.4 21.3,40.4 v21.6,40.7
  Bottom 0.2: U$1.34 4.51,38.75 3.79,39.47 3.79,41.39 5.13,42.73 5.13,43.01 6.3,44.17 v6.9,44.17 6.9,45.37 5.12,47.15 JP1.2 | v21.6,40.7 22,40.7 22.25,40.95 U1.13
(copper drawn outside any net)
  shapes: Bottom circle x1, Top circle x2

## Text on the board
Bottom: (rev A)
tPlace: Magnet 1 | Magnet 2 | Magnet 8 | <- Display -> | Magnet 4 | Magnet 3 | Magnet 9 | Magnet 6 | Magnet 7
bPlace: Magnet 1 | Magnet 2 | Magnet 8 | Rahul Butani, / Blake Martini, / Sameer Mithani, / Sneha Pendharkar | Magnet 4 | Magnet 9 | Magnet 6 | Magnet 7
Document: 2mm should be enough to account for the 0.5mm tolerance, the bend, and going through the hole